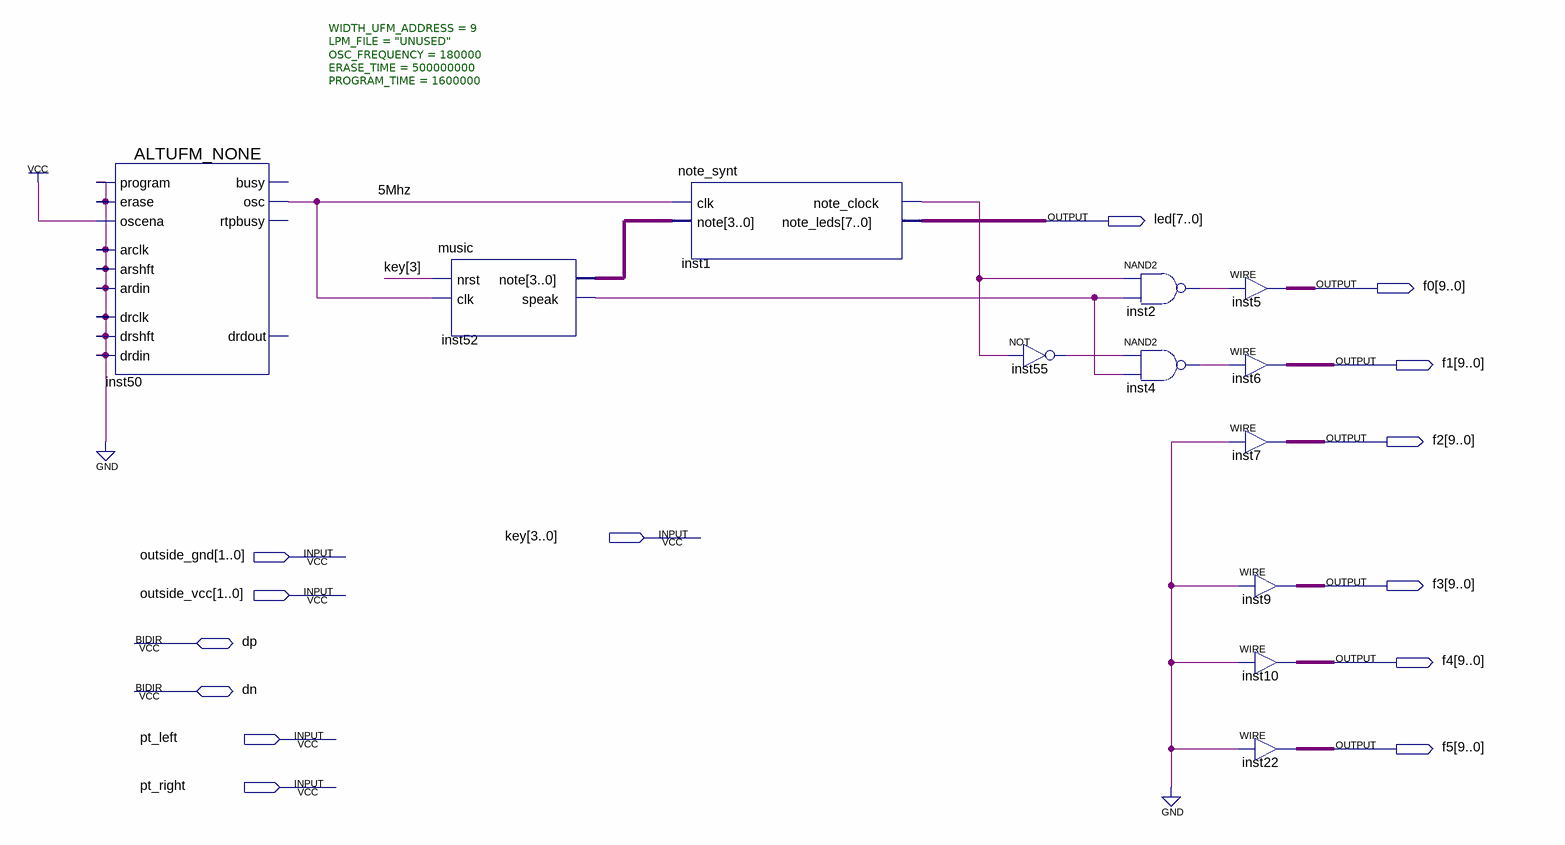
[diagram p0: schematic sheet]
// Quartus schematic max2.bdf as structural Verilog: 12 symbols, 14 pins
module max2 (
  input  [3:0] key,
  input  [1:0] outside_gnd,
  input  [1:0] outside_vcc,
  input  pt_left,
  input  pt_right,
  inout  dp,
  inout  dn,
  output [7:0] led,
  output [9:0] f0,
  output [9:0] f1,
  output [9:0] f2,
  output [9:0] f3,
  output [9:0] f4,
  output [9:0] f5
);

  wire \5Mhz , inst1_note_clock, inst2_out, inst4_out, inst52_speak, inst55_out;
  wire [3:0] inst52_note;

  ALTUFM_NONE #(.WIDTH_UFM_ADDRESS(9), .LPM_FILE("UNUSED"), .OSC_FREQUENCY(180000), .ERASE_TIME(500000000), .PROGRAM_TIME(1600000)) inst50 (
    .\program (1'b0), .erase(1'b0), .oscena(1'b1), .arclk(1'b0), .arshft(1'b0), .ardin(1'b0), .drclk(1'b0),
    .drshft(1'b0), .drdin(1'b0), .osc(\5Mhz ));  // open: busy, rtpbusy, drdout
  music inst52 (.nrst(key[3]), .clk(\5Mhz ), .note(inst52_note), .speak(inst52_speak));
  note_synt inst1 (.clk(\5Mhz ), .note(inst52_note), .note_clock(inst1_note_clock), .note_leds(led));
  not inst55 (inst55_out, inst1_note_clock);
  nand inst2 (inst2_out, inst1_note_clock, inst52_speak);
  nand inst4 (inst4_out, inst55_out, inst52_speak);
  assign f0 = {10{inst2_out}};  // WIRE inst5
  assign f1 = {10{inst4_out}};  // WIRE inst6
  assign f2 = {10{1'b0}};  // WIRE inst7
  assign f3 = {10{1'b0}};  // WIRE inst9
  assign f4 = {10{1'b0}};  // WIRE inst10
  assign f5 = {10{1'b0}};  // WIRE inst22
endmodule
